# Altium project 遥控器主板.PrjPcb
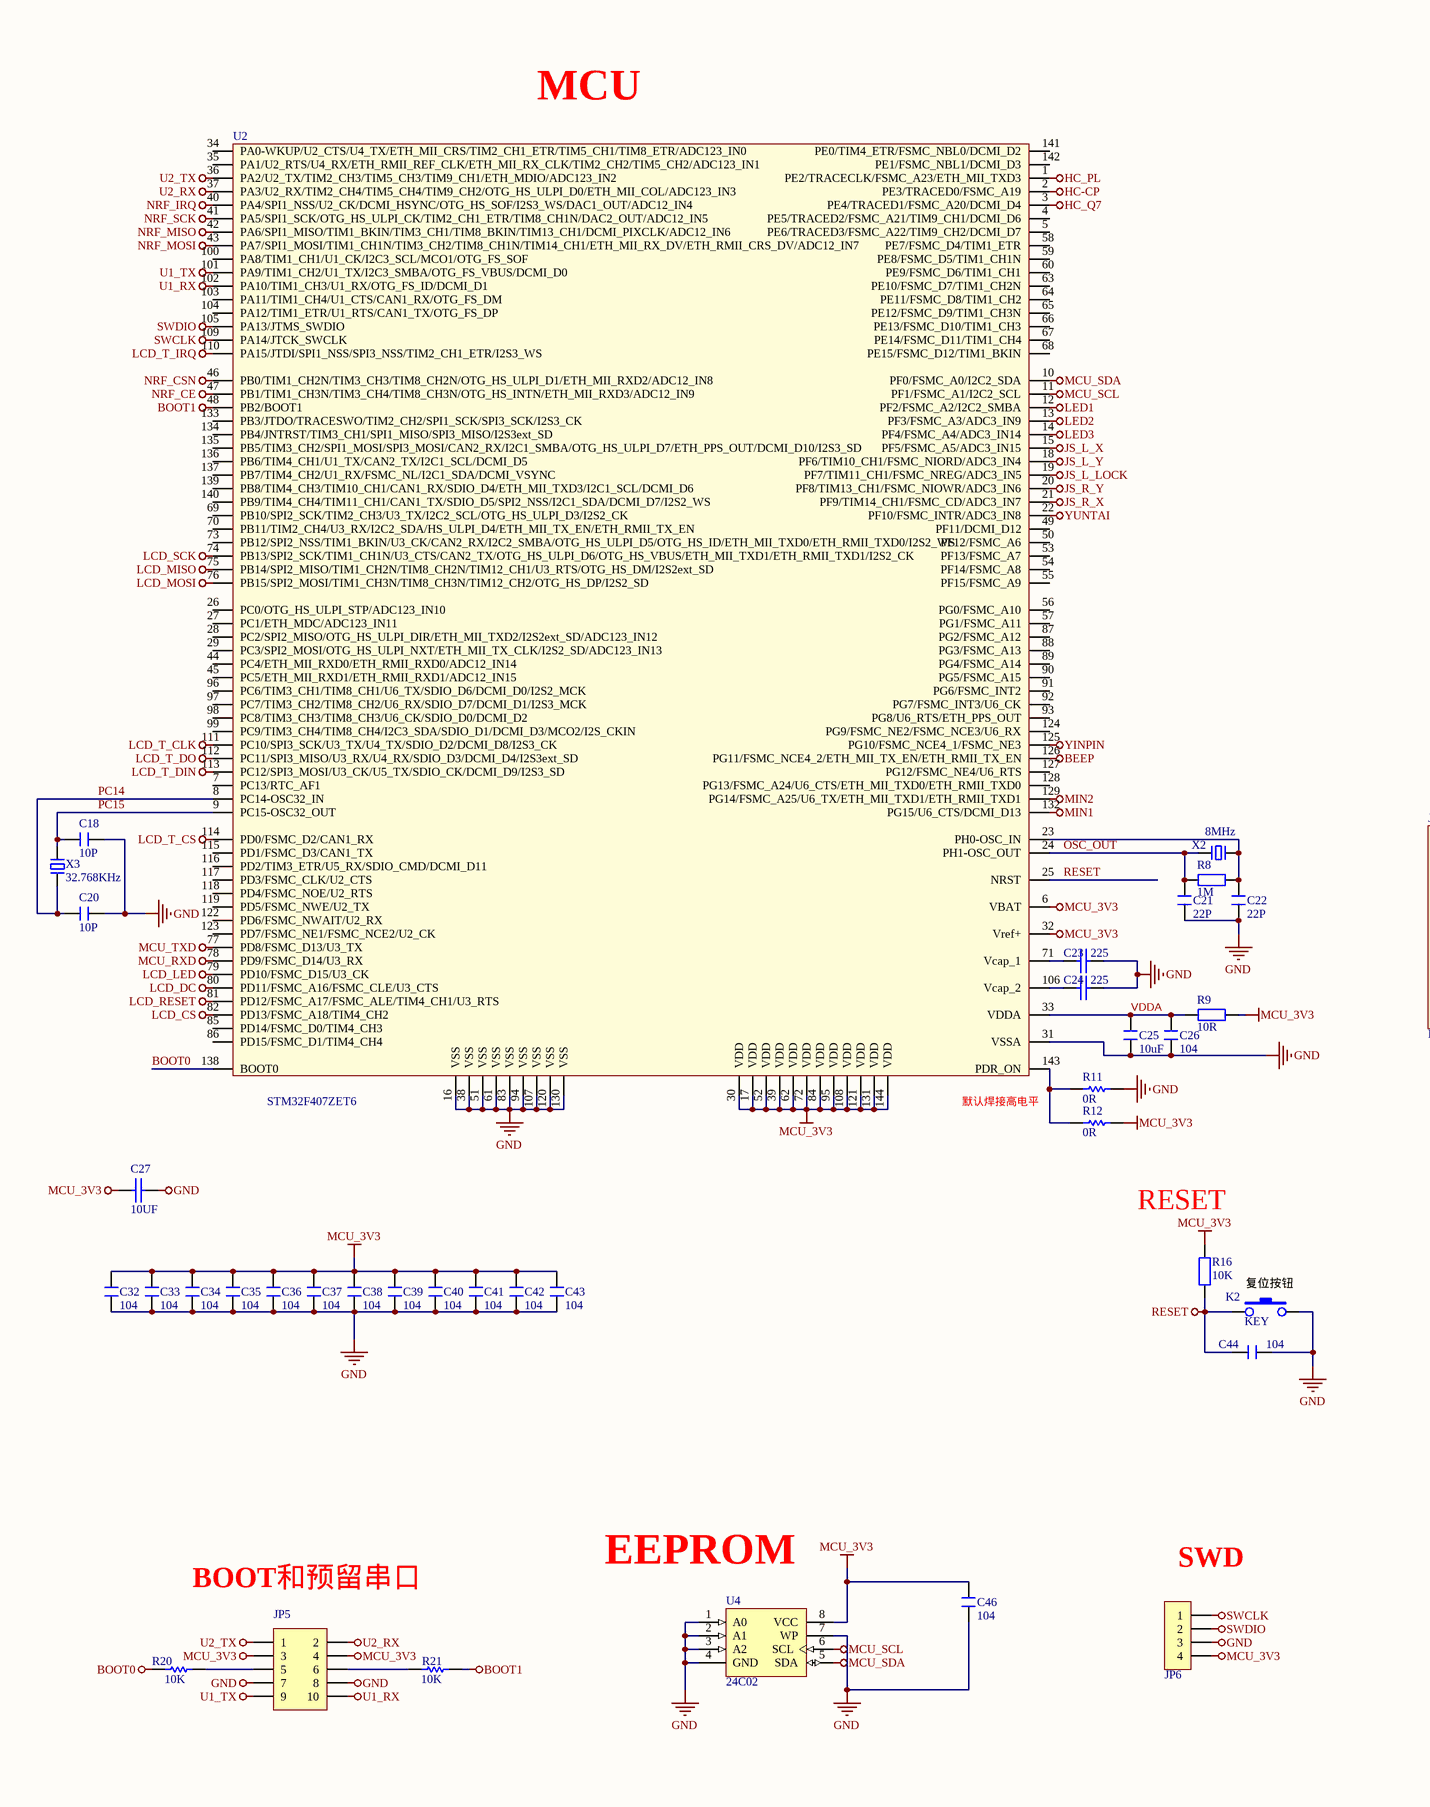
[diagram p0: 遥控器主板.SchDoc, left]
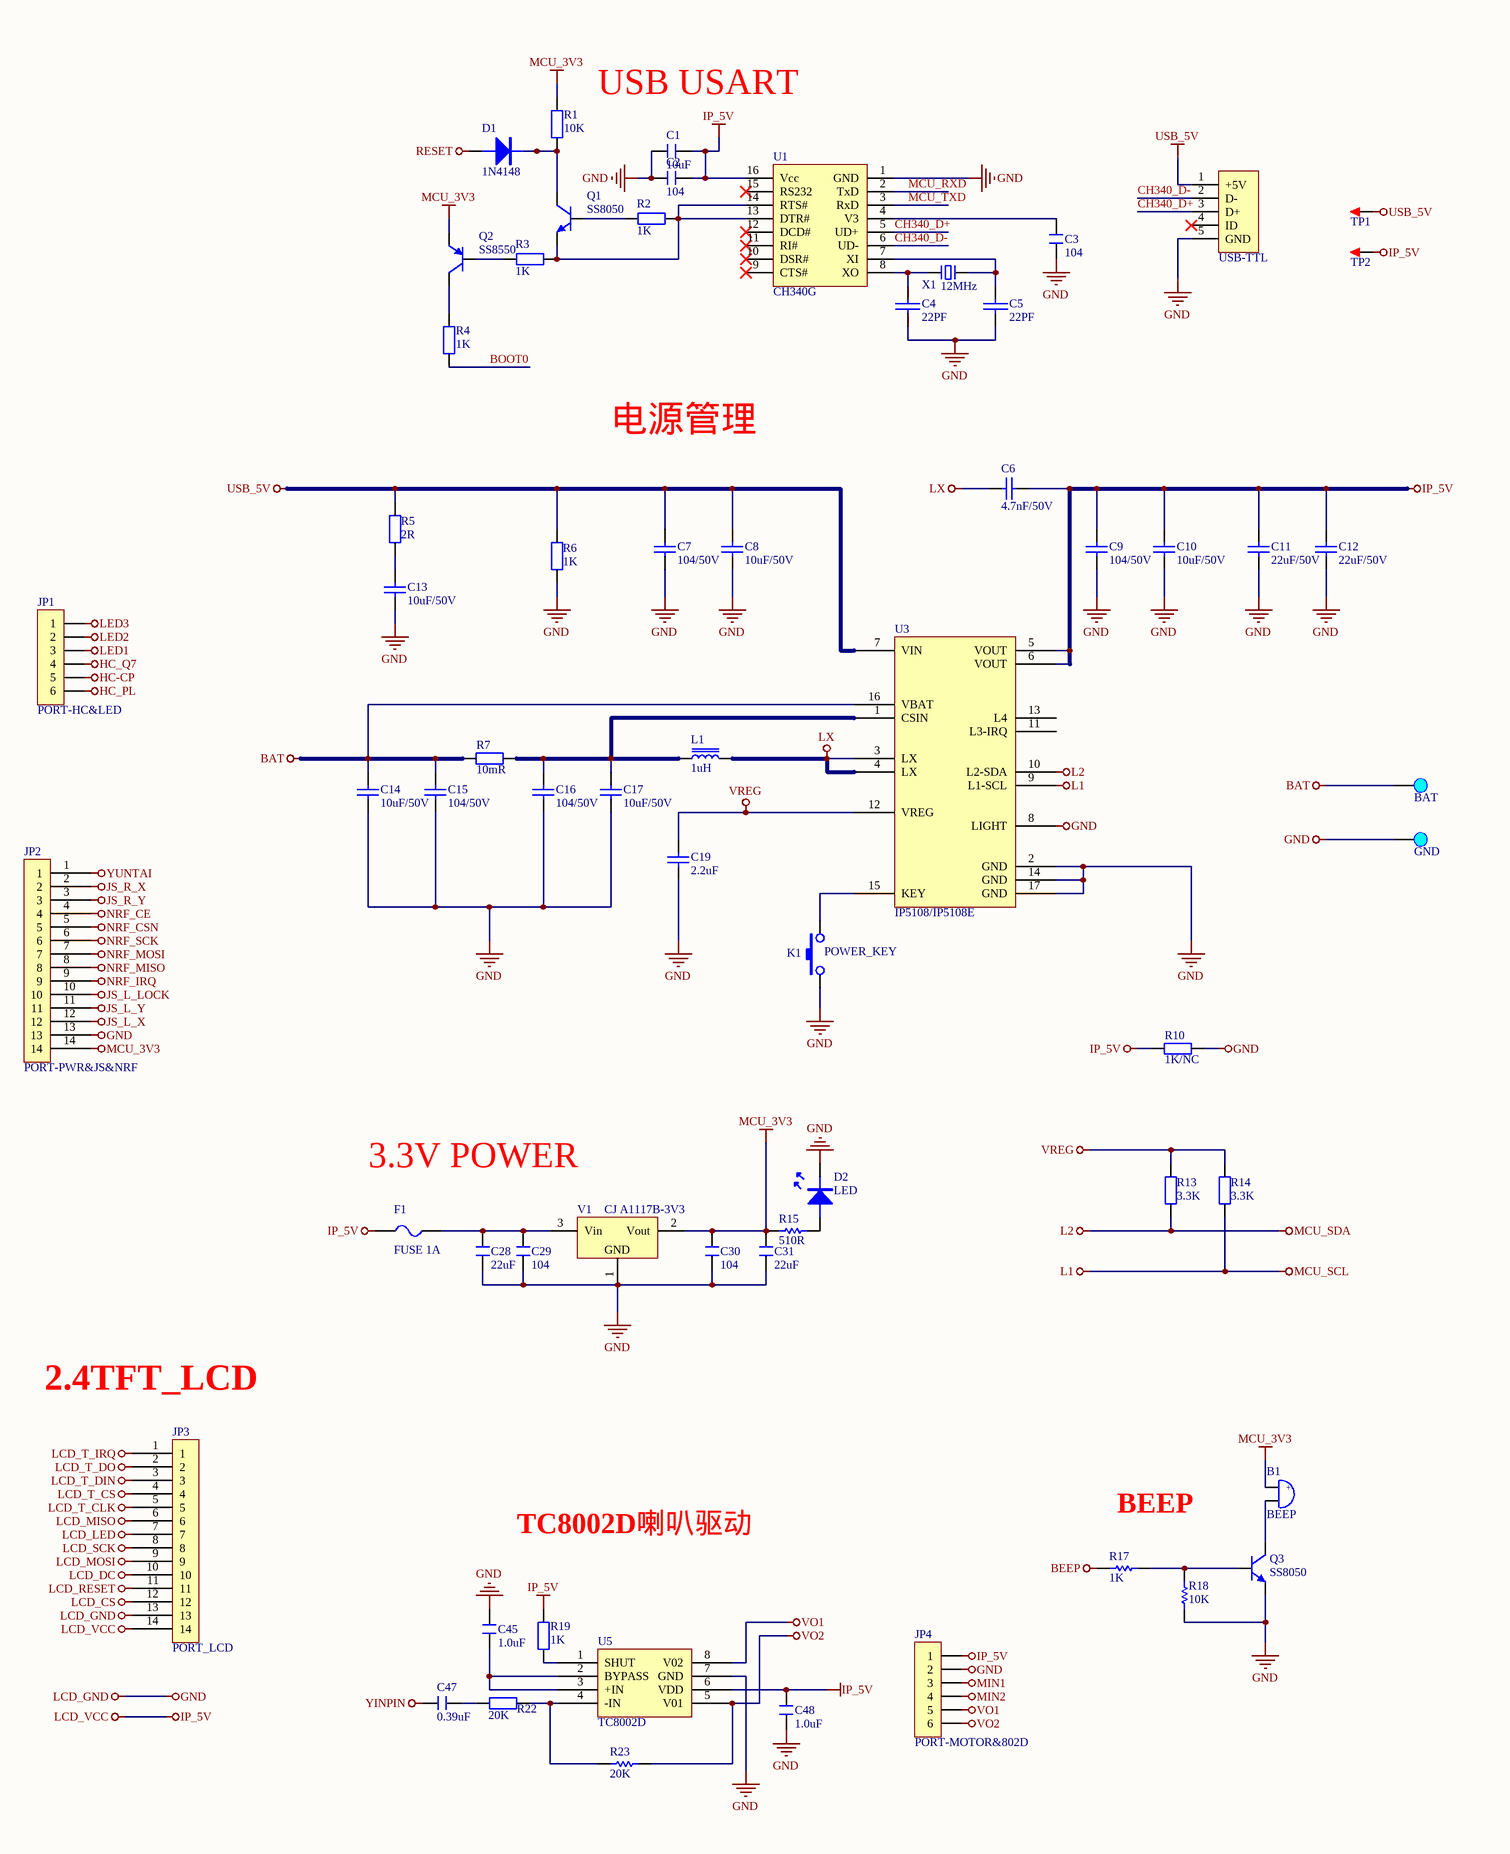
[diagram p1: 遥控器主板.SchDoc, right]
1 sheet, 101 parts. Net scope: global (net labels, ports and power ports of the same name join across sheets).
Board file: 遥控器主板.PcbDoc

## Sheet 遥控器主板.SchDoc
size A2

### Parts
B1  BEEP  [BEEP 7.6X12X7.5]
C1  10uF  [0603C]
C2  104  [0603C]
C3  104  [0603C]
C4  22PF  [0603C]
C5  22PF  [0603C]
C6  _Parameter: 4.7nF/50V  [0603C]  (hidden comment: 4.7nF)
C7  _Parameter: 104/50V  [0603C]  (hidden comment: 104)
C8  _Parameter: 10uF/50V  [0603C]  (hidden comment: 10uF)
C9  _Parameter: 104/50V  [0603C]  (hidden comment: 104)
C10  _Parameter: 10uF/50V  [0603C]  (hidden comment: 10uF)
C11  _Parameter: 22uF/50V  [0603C]  (hidden comment: 22uF)
C12  _Parameter: 22uF/50V  [0603C]  (hidden comment: 22uF)
C13  _Parameter: 10uF/50V  [0603C]  (hidden comment: 10uF)
C14  _Parameter: 10uF/50V  [0603C]  (hidden comment: 10uF)
C15  _Parameter: 104/50V  [0603C]  (hidden comment: 104)
C16  _Parameter: 104/50V  [0603C]  (hidden comment: 104)
C17  _Parameter: 10uF/50V  [0603C]  (hidden comment: 10uF)
C18  10P  [0603C]
C19  _Parameter: 2.2uF  [0603C]  (hidden comment: 104)
C20  10P  [0603C]
C21  22P  [0603C]
C22  22P  [0603C]
C23  225  [0603C]
C24  225  [0603C]
C25  10uF  [0603C]
C26  104  [0603C]
C27  10UF  [0603C]
C28  22uF  [0603C]
C29  104  [0603C]
C30  104  [0603C]
C31  22uF  [0603C]
C32  104  [0603C]
C33  104  [0603C]
C34  104  [0603C]
C35  104  [0603C]
C36  104  [0603C]
C37  104  [0603C]
C38  104  [0603C]
C39  104  [0603C]
C40  104  [0603C]
C41  104  [0603C]
C42  104  [0603C]
C43  104  [0603C]
C44  104  [0603C]
C45  1.0uF  [0603C]
C46  104  [0603C]
C47  0.39uF  [0603C]
C48  1.0uF  [0603C]
D1  1N4148  [SOD-323]
D2  LED  [LED-0603G]
F1  FUSE 1A  [FU 0805]
JP1  PORT-HC&LED  [SH1.0 S-W-6P]
JP2  PORT-PWR&JS&NRF  [Headr14]
JP3  PORT_LCD  [Headr14]
JP4  PORT-MOTOR&802D  [SH1.0 S-W-6P]
JP5  Header 5X2  [HDR2.54-LI-2x5P]  (value not drawn)
JP6  SWD  [XH2.54-WI-4P]  (value not drawn)
K1  POWER_KEY  [SMD-3X6X2.5]
K2  KEY  [SMD-3X6X2.5]
L1  1uH  [CD54]
Pad1  BAT  [TEST PAD 1.8]
Pad2  GND  [TEST PAD 1.8]
Q1  SS8050  [SOT23-3L]
Q2  SS8550  [SOT23-3L]
Q3  SS8050  [SOT23-3L]
R1  10K  [0805R]
R2  1K  [0805R]
R3  1K  [0805R]
R4  1K  [0805R]
R5  2R  [0805R]
R6  1K  [0805R]
R7  10mR  [2512R]
R8  1M  [0805R]
R9  10R  [0805R]
R10  1K/NC  [0805R]
R11  0R  [0805R]
R12  0R  [0805R]
R13  3.3K  [0805R]
R14  3.3K  [0805R]
R15  510R  [0805R]
R16  10K  [0805R]
R17  1K  [0805R]
R18  10K  [0805R]
R19  1K  [0805R]
R20  10K  [0805R]
R21  10K  [0805R]
R22  20K  [0805R]
R23  20K  [0805R]
TP1  TEST  [TEST PAD 1.8]  (value not drawn)
TP2  TEST  [TEST PAD 1.8]  (value not drawn)
U1  CH340G  [SOP16_L]
U2  STM32F407ZET6  [LQFP144 20X20_M]
U3  IP5108/IP5108E  [SOP16_PWR]
U4  24C02  [SOP8_L]
U5  TC8002D  [SOP8_L]
USB1  USB-TTL  [USB-MINI-A]
V1  CJ A1117B-3V3  [SOT89_L]
X1  12MHz  [OSC HC-49S]
X2  8MHz  [OSC HC-49S]
X3  32.768KHz  [OSC HC-49S]

### Nets
BAT: C14.2 C15.2 Pad1.1 R7.1 U3.16(VBAT)
BEEP: R17.1 U2.126(PG11/FSMC_NCE4_2/ETH_MII_TX_EN/ETH_RMII_TX_EN)
BOOT0: R4.2 R20.1 U2.138(BOOT0)
BOOT1: R21.2 U2.48(PB2/BOOT1)
GND: C1.1 C2.1 C3.1 C4.1 C5.1 C7.1 C8.1 C9.1 C10.1 C11.1 C12.1 C13.1 C14.1 C15.1 C16.1 C17.1 C18.2 C19.1 C20.2 C21.1 C22.1 C23.2 C24.2 C25.1 C26.1 C27.2 C28.1 C29.1 C30.1 C31.1 C32.1 C33.1 C34.1 C35.1 C36.1 C37.1 C38.1 C39.1 C40.1 C41.1 C42.1 C43.1 C44.1 C45.2 C46.1 C48.1 D2.K JP2.13 JP3.13 JP4.2 JP5.7 JP5.8 JP6.3 K1.1 K2.3 Pad2.1 Q3.2(E) R6.2 R10.2 R11.2 R18.1 U1.1(GND) U2.16(VSS) U2.31(VSSA) U2.38(VSS) U2.51(VSS) U2.61(VSS) U2.83(VSS) U2.94(VSS) U2.107(VSS) U2.120(VSS) U2.130(VSS) U3.2(GND) U3.8(LIGHT) U3.14(GND) U3.17(GND) U4.1(A0) U4.2(A1) U4.3(A2) U4.4(GND) U4.7(WP) U5.7(GND) USB1.5(GND) V1.1(GND)  [also labelled LCD_GND]
HC-CP: JP1.5 U2.2(PE3/TRACED0/FSMC_A19)
HC_PL: JP1.6 U2.1(PE2/TRACECLK/FSMC_A23/ETH_MII_TXD3)
HC_Q7: JP1.4 U2.3(PE4/TRACED1/FSMC_A20/DCMI_D4)
IP_5V: C1.2 C2.2 C6.1 C9.2 C10.2 C11.2 C12.2 C48.2 F1.1 JP3.14 JP4.1 R10.1 R19.2 TP2.1 U1.16(Vcc) U3.5(VOUT) U3.6(VOUT) U5.6(VDD)  [also labelled LCD_VCC]
JS_L_LOCK: JP2.10 U2.19(PF7/TIM11_CH1/FSMC_NREG/ADC3_IN5)
JS_L_X: JP2.12 U2.15(PF5/FSMC_A5/ADC3_IN15)
JS_L_Y: JP2.11 U2.18(PF6/TIM10_CH1/FSMC_NIORD/ADC3_IN4)
JS_R_X: JP2.2 U2.21(PF9/TIM14_CH1/FSMC_CD/ADC3_IN7)
JS_R_Y: JP2.3 U2.20(PF8/TIM13_CH1/FSMC_NIOWR/ADC3_IN6)
L1: R14.1 U2.11(PF1/FSMC_A1/I2C2_SCL) U3.9(L1-SCL) U4.6(SCL)  [also labelled MCU_SCL]
L2: R13.1 U2.10(PF0/FSMC_A0/I2C2_SDA) U3.10(L2-SDA) U4.5(SDA)  [also labelled MCU_SDA]
LCD_CS: JP3.12 U2.82(PD13/FSMC_A18/TIM4_CH2)
LCD_DC: JP3.10 U2.80(PD11/FSMC_A16/FSMC_CLE/U3_CTS)
LCD_LED: JP3.7 U2.79(PD10/FSMC_D15/U3_CK)
LCD_MISO: JP3.6 U2.75(PB14/SPI2_MISO/TIM1_CH2N/TIM8_CH2N/TIM12_CH1/U3_RTS/OTG_HS_DM/I2S2ext_SD)
LCD_MOSI: JP3.9 U2.76(PB15/SPI2_MOSI/TIM1_CH3N/TIM8_CH3N/TIM12_CH2/OTG_HS_DP/I2S2_SD)
LCD_RESET: JP3.11 U2.81(PD12/FSMC_A17/FSMC_ALE/TIM4_CH1/U3_RTS)
LCD_SCK: JP3.8 U2.74(PB13/SPI2_SCK/TIM1_CH1N/U3_CTS/CAN2_TX/OTG_HS_ULPI_D6/OTG_HS_VBUS/ETH_MII_TXD1/ETH_RMII_TXD1/I2S2_CK)
LCD_T_CLK: JP3.5 U2.111(PC10/SPI3_SCK/U3_TX/U4_TX/SDIO_D2/DCMI_D8/I2S3_CK)
LCD_T_CS: JP3.4 U2.114(PD0/FSMC_D2/CAN1_RX)
LCD_T_DIN: JP3.3 U2.113(PC12/SPI3_MOSI/U3_CK/U5_TX/SDIO_CK/DCMI_D9/I2S3_SD)
LCD_T_DO: JP3.2 U2.112(PC11/SPI3_MISO/U3_RX/U4_RX/SDIO_D3/DCMI_D4/I2S3ext_SD)
LCD_T_IRQ: JP3.1 U2.110(PA15/JTDI/SPI1_NSS/SPI3_NSS/TIM2_CH1_ETR/I2S3_WS)
LED1: JP1.3 U2.12(PF2/FSMC_A2/I2C2_SMBA)
LED2: JP1.2 U2.13(PF3/FSMC_A3/ADC3_IN9)
LED3: JP1.1 U2.14(PF4/FSMC_A4/ADC3_IN14)
LX: C6.2 L1.2 U3.3(LX) U3.4(LX)
MCU_3V3: B1.1 C27.1 C30.2 C31.2 C32.2 C33.2 C34.2 C35.2 C36.2 C37.2 C38.2 C39.2 C40.2 C41.2 C42.2 C43.2 C46.2 JP2.14 JP5.3 JP5.4 JP6.4 Q2.2(E) R1.2 R9.2 R12.2 R15.2 R16.2 U2.6(VBAT) U2.17(VDD) U2.30(VDD) U2.32(Vref+) U2.39(VDD) U2.52(VDD) U2.62(VDD) U2.72(VDD) U2.84(VDD) U2.95(VDD) U2.108(VDD) U2.121(VDD) U2.131(VDD) U2.144(VDD) U4.8(VCC) V1.2(Vout)
MCU_RXD: U1.2(TxD) U2.78(PD9/FSMC_D14/U3_RX)
MCU_TXD: U1.3(RxD) U2.77(PD8/FSMC_D13/U3_TX)
MIN1: JP4.3 U2.132(PG15/U6_CTS/DCMI_D13)
MIN2: JP4.4 U2.129(PG14/FSMC_A25/U6_TX/ETH_MII_TXD1/ETH_RMII_TXD1)
NRF_CE: JP2.4 U2.47(PB1/TIM1_CH3N/TIM3_CH4/TIM8_CH3N/OTG_HS_INTN/ETH_MII_RXD3/ADC12_IN9)
NRF_CSN: JP2.5 U2.46(PB0/TIM1_CH2N/TIM3_CH3/TIM8_CH2N/OTG_HS_ULPI_D1/ETH_MII_RXD2/ADC12_IN8)
NRF_IRQ: JP2.9 U2.40(PA4/SPI1_NSS/U2_CK/DCMI_HSYNC/OTG_HS_SOF/I2S3_WS/DAC1_OUT/ADC12_IN4)
NRF_MISO: JP2.8 U2.42(PA6/SPI1_MISO/TIM1_BKIN/TIM3_CH1/TIM8_BKIN/TIM13_CH1/DCMI_PIXCLK/ADC12_IN6)
NRF_MOSI: JP2.7 U2.43(PA7/SPI1_MOSI/TIM1_CH1N/TIM3_CH2/TIM8_CH1N/TIM14_CH1/ETH_MII_RX_DV/ETH_RMII_CRS_DV/ADC12_IN7)
NRF_SCK: JP2.6 U2.41(PA5/SPI1_SCK/OTG_HS_ULPI_CK/TIM2_CH1_ETR/TIM8_CH1N/DAC2_OUT/ADC12_IN5)
RESET: C44.2 D1.A K2.1 R16.1 U2.25(NRST)
SWCLK: JP6.1 U2.109(PA14/JTCK_SWCLK)
SWDIO: JP6.2 U2.105(PA13/JTMS_SWDIO)
U1_RX: JP5.10 U2.102(PA10/TIM1_CH3/U1_RX/OTG_FS_ID/DCMI_D1)
U1_TX: JP5.9 U2.101(PA9/TIM1_CH2/U1_TX/I2C3_SMBA/OTG_FS_VBUS/DCMI_D0)
U2_RX: JP5.2 U2.37(PA3/U2_RX/TIM2_CH4/TIM5_CH4/TIM9_CH2/OTG_HS_ULPI_D0/ETH_MII_COL/ADC123_IN3)
U2_TX: JP5.1 U2.36(PA2/U2_TX/TIM2_CH3/TIM5_CH3/TIM9_CH1/ETH_MDIO/ADC123_IN2)
USB_5V: C7.2 C8.2 R5.1 R6.1 TP1.1 U3.7(VIN) USB1.1(+5V)
VO1: JP4.5 U5.8(V02)
VO2: JP4.6 R23.2 U5.5(V01)
VREG: C19.2 R13.2 R14.2 U3.12(VREG)
YINPIN: C47.2 U2.125(PG10/FSMC_NCE4_1/FSMC_NE3)
YUNTAI: JP2.1 U2.22(PF10/FSMC_INTR/ADC3_IN8)
CH340_D+: U1.5(UD+) USB1.3(D+)
CH340_D-: U1.6(UD-) USB1.2(D-)
OSC_OUT: C21.2 R8.1 U2.24(PH1-OSC_OUT) X2.2
PC14: C20.1 U2.8(PC14-OSC32_IN) X3.1
PC15: C18.1 U2.9(PC15-OSC32_OUT) X3.2
VDDA: C25.2 C26.2 R9.1 U2.33(VDDA)
NetB1_2: B1.2 Q3.3(C)
NetC3_2: C3.2 U1.4(V3)
NetC4_2: C4.2 U1.8(XO) X1.1
NetC5_2: C5.2 U1.7(XI) X1.2
NetC13_2: C13.2 R5.2
NetC16_2: C16.2 C17.2 L1.1 R7.2 U3.1(CSIN)
NetC22_2: C22.2 R8.2 U2.23(PH0-OSC_IN) X2.1
NetC23_1: C23.1 U2.71(Vcap_1)
NetC24_1: C24.1 U2.106(Vcap_2)
NetC28_2: C28.2 C29.2 F1.2 V1.3(Vin)
NetC45_1: C45.1 U5.2(BYPASS) U5.3(+IN)
NetC47_1: C47.1 R22.1
NetD1_K: D1.K Q1.3(C) R1.1
NetD2_A: D2.A R15.1
NetJP5_5: JP5.5 R20.2
NetJP5_6: JP5.6 R21.1
NetK1_3: K1.3 U3.15(KEY)
NetQ1_1: Q1.1(B) R2.2
NetQ1_2: Q1.2(E) R2.1 R3.1 U1.13(DTR#) U1.14(RTS#)
NetQ2_1: Q2.1(B) R3.2
NetQ2_3: Q2.3(C) R4.1
NetQ3_1: Q3.1(B) R17.2 R18.2
NetR11_1: R11.1 R12.1 U2.143(PDR_ON)
NetR19_1: R19.1 U5.1(SHUT)
NetR22_2: R22.2 R23.1 U5.4(-IN)

Not connected (* = marked no-connect by the designer): U1 9(CTS#)* 10(DSR#)* 11(RI#)* 12(DCD#)* 15(RS232)*; U2 4(PE5/TRACED2/FSMC_A21/TIM9_CH1/DCMI_D6) 5(PE6/TRACED3/FSMC_A22/TIM9_CH2/DCMI_D7) 7(PC13/RTC_AF1) 26(PC0/OTG_HS_ULPI_STP/ADC123_IN10) 27(PC1/ETH_MDC/ADC123_IN11) 28(PC2/SPI2_MISO/OTG_HS_ULPI_DIR/ETH_MII_TXD2/I2S2ext_SD/ADC123_IN12) 29(PC3/SPI2_MOSI/OTG_HS_ULPI_NXT/ETH_MII_TX_CLK/I2S2_SD/ADC123_IN13) 34(PA0-WKUP/U2_CTS/U4_TX/ETH_MII_CRS/TIM2_CH1_ETR/TIM5_CH1/TIM8_ETR/ADC123_IN0) 35(PA1/U2_RTS/U4_RX/ETH_RMII_REF_CLK/ETH_MII_RX_CLK/TIM2_CH2/TIM5_CH2/ADC123_IN1) 44(PC4/ETH_MII_RXD0/ETH_RMII_RXD0/ADC12_IN14) 45(PC5/ETH_MII_RXD1/ETH_RMII_RXD1/ADC12_IN15) 49(PF11/DCMI_D12) 50(PF12/FSMC_A6) 53(PF13/FSMC_A7) 54(PF14/FSMC_A8) 55(PF15/FSMC_A9) 56(PG0/FSMC_A10) 57(PG1/FSMC_A11) 58(PE7/FSMC_D4/TIM1_ETR) 59(PE8/FSMC_D5/TIM1_CH1N) 60(PE9/FSMC_D6/TIM1_CH1) 63(PE10/FSMC_D7/TIM1_CH2N) 64(PE11/FSMC_D8/TIM1_CH2) 65(PE12/FSMC_D9/TIM1_CH3N) 66(PE13/FSMC_D10/TIM1_CH3) 67(PE14/FSMC_D11/TIM1_CH4) 68(PE15/FSMC_D12/TIM1_BKIN) 69(PB10/SPI2_SCK/TIM2_CH3/U3_TX/I2C2_SCL/OTG_HS_ULPI_D3/I2S2_CK) 70(PB11/TIM2_CH4/U3_RX/I2C2_SDA/HS_ULPI_D4/ETH_MII_TX_EN/ETH_RMII_TX_EN) 73(PB12/SPI2_NSS/TIM1_BKIN/U3_CK/CAN2_RX/I2C2_SMBA/OTG_HS_ULPI_D5/OTG_HS_ID/ETH_MII_TXD0/ETH_RMII_TXD0/I2S2_WS) 85(PD14/FSMC_D0/TIM4_CH3) 86(PD15/FSMC_D1/TIM4_CH4) 87(PG2/FSMC_A12) 88(PG3/FSMC_A13) 89(PG4/FSMC_A14) 90(PG5/FSMC_A15) 91(PG6/FSMC_INT2) 92(PG7/FSMC_INT3/U6_CK) 93(PG8/U6_RTS/ETH_PPS_OUT) 96(PC6/TIM3_CH1/TIM8_CH1/U6_TX/SDIO_D6/DCMI_D0/I2S2_MCK) 97(PC7/TIM3_CH2/TIM8_CH2/U6_RX/SDIO_D7/DCMI_D1/I2S3_MCK) 98(PC8/TIM3_CH3/TIM8_CH3/U6_CK/SDIO_D0/DCMI_D2) 99(PC9/TIM3_CH4/TIM8_CH4/I2C3_SDA/SDIO_D1/DCMI_D3/MCO2/I2S_CKIN) 100(PA8/TIM1_CH1/U1_CK/I2C3_SCL/MCO1/OTG_FS_SOF) 103(PA11/TIM1_CH4/U1_CTS/CAN1_RX/OTG_FS_DM) 104(PA12/TIM1_ETR/U1_RTS/CAN1_TX/OTG_FS_DP) 115(PD1/FSMC_D3/CAN1_TX) 116(PD2/TIM3_ETR/U5_RX/SDIO_CMD/DCMI_D11) 117(PD3/FSMC_CLK/U2_CTS) 118(PD4/FSMC_NOE/U2_RTS) 119(PD5/FSMC_NWE/U2_TX) 122(PD6/FSMC_NWAIT/U2_RX) 123(PD7/FSMC_NE1/FSMC_NCE2/U2_CK) 124(PG9/FSMC_NE2/FSMC_NCE3/U6_RX) 127(PG12/FSMC_NE4/U6_RTS) 128(PG13/FSMC_A24/U6_CTS/ETH_MII_TXD0/ETH_RMII_TXD0) 133(PB3/JTDO/TRACESWO/TIM2_CH2/SPI1_SCK/SPI3_SCK/I2S3_CK) 134(PB4/JNTRST/TIM3_CH1/SPI1_MISO/SPI3_MISO/I2S3ext_SD) 135(PB5/TIM3_CH2/SPI1_MOSI/SPI3_MOSI/CAN2_RX/I2C1_SMBA/OTG_HS_ULPI_D7/ETH_PPS_OUT/DCMI_D10/I2S3_SD) 136(PB6/TIM4_CH1/U1_TX/CAN2_TX/I2C1_SCL/DCMI_D5) 137(PB7/TIM4_CH2/U1_RX/FSMC_NL/I2C1_SDA/DCMI_VSYNC) 139(PB8/TIM4_CH3/TIM10_CH1/CAN1_RX/SDIO_D4/ETH_MII_TXD3/I2C1_SCL/DCMI_D6) 140(PB9/TIM4_CH4/TIM11_CH1/CAN1_TX/SDIO_D5/SPI2_NSS/I2C1_SDA/DCMI_D7/I2S2_WS) 141(PE0/TIM4_ETR/FSMC_NBL0/DCMI_D2) 142(PE1/FSMC_NBL1/DCMI_D3); U3 11(L3-IRQ) 13(L4); USB1 4(ID)*

### Notes on the sheet
- USB USART
- (near U2) MCU
- 电源管理
- (near U2) 默认焊接高电平
- 3.3V POWER
- (near R16) RESET
- (near K2) 复位按钮
- 2.4TFT_LCD
- BEEP
- (near U4) EEPROM
- (near JP6) SWD
- TC8002D喇叭驱动
- BOOT和预留串口
- (in symbol BEEP) +

### Library data of the parts
B1 = BEEP: 蜂鸣器
C1-C3 C18 C20-C22 C25 C26 C28-C48 = C: 无极性贴片电容; 版权归属: 源创客; 材质: X7R; BOM名称: 无极性贴片电容; 学习资源: www.ooocke.com
C4 C5 C23 C24 C27 = CAP: 无极性电容
C6 = Cap: _Material: X7R; _Voltage: 50V; _Slash: /; _Specification: Cap,0805,X7R,4.7nF,50V,10%; _Comma: ,; _Accuracy: 10%; _Footprint: 0805; _Capacitance: 4.7nF; _Name: Cap
C7 C9 C15 C16 C19 = Cap: _Material: X7R; _Voltage: 50V; _Slash: /; _Specification: Cap,0805,X7R,104,50V,10%; _Comma: ,; _Accuracy: 10%; _Footprint: 0805; _Capacitance: 104; _Name: Cap
C8 C10 C13 C14 C17 = Cap: _Material: X7R; _Voltage: 50V; _Slash: /; _Specification: Cap,0805,X7R,10uF,50V,10%; _Comma: ,; _Accuracy: 10%; _Footprint: 0805; _Capacitance: 10uF; _Name: Cap
C11 C12 = Cap: _Material: X7R; _Voltage: 50V; _Slash: /; _Specification: Cap,0805,X7R,22uF,50V,10%; _Comma: ,; _Accuracy: 10%; _Footprint: 0805; _Capacitance: 22uF; _Name: Cap
D1 = DIODE: 普通二极管
F1 = FU: 贴片保险丝; 版权归属: 源创客; BOM名称: 贴片保险丝; 学习资源: www.ooocke.com
JP1 JP4 = Header 6: 6P接插件; 版权归属: 源创客; BOM名称: 6P接插件; 学习资源: www.ooocke.com
JP2 JP3 = HEADER 14: 卧贴 14PIN 1.25mm
JP5 = Header 5X2: 5*2P接插件; 版权归属: 源创客; BOM名称: 5*2P接插件; 学习资源: www.ooocke.com
JP6 = Header 4: 4P接插件; 版权归属: 源创客; BOM名称: 4P接插件; 学习资源: www.ooocke.com
K1 = KEY
L1 = Inductor Iron 2: _Current: 10A; _Accuracy: 20%; _Footprint: 1040; _Name: IND; _Specification: IND,1040,1uH,10A,20%; _Comma: ,; _Value: 1uH
Pad1 = Pad: _Funcyusa: Test; _Specification: Pad,Test,BAT; _Comma: ,; _Name: Pad; _Remarks: BAT
Pad2 = Pad: _Funcyusa: Test; _Specification: Pad,Test,GND; _Comma: ,; _Name: Pad; _Remarks: GND
Q1 Q3 = 8050-SMD: 高频放大-NPN型; 版权归属: 源创客; 属性: 40V 1.5A 1W 100MHZ; BOM名称: 高频放大-NPN型; 学习资源: www.ooocke.com
Q2 = 8550-SMD: 高频放大-PNP型; 版权归属: 源创客; 属性: 40V 1.5A 1W 100MHZ; BOM名称: 高频放大-PNP型; 学习资源: www.ooocke.com
R1-R4 R8 R9 R16 R19 R22 = R: 贴片电阻; 版权归属: 源创客; BOM名称: 贴片电阻; 学习资源: www.ooocke.com
R5 = Res: _Accuracy: 1%; _Power: 1/8W; _Footprint: 0805; _Drift: 100ppm; _Comma: ,; _Specification: Res,0805,2R,1%,1/8W,100ppm; _Name: Res; _Value: 2R
R6 = Res: _Accuracy: 1%; _Power: 1/8W; _Footprint: 0805; _Drift: 100ppm; _Comma: ,; _Specification: Res,0805,1K,1%,1/8W,100ppm; _Name: Res; _Value: 1K
R7 = Res: _Accuracy: 1%; _Power: 1/8W; _Footprint: 0805; _Drift: 100ppm; _Comma: ,; _Specification: Res,0805,10mR,1%,1/8W,100ppm; _Name: Res; _Value: 10mR
R10 = Res: _Accuracy: 1%; _Power: 1/8W; _Footprint: 0805; _Drift: 100ppm; _Comma: ,; _Specification: Res,0805,1K/NC,1%,1/8W,100ppm; _Name: Res; _Value: 1K/NC
R11 R12 R15 R17 R18 R20 R21 R23 = RES
R13 R14 = Res: _Accuracy: 1%; _Power: 1/8W; _Footprint: 0805; _Drift: 100ppm; _Comma: ,; _Specification: Res,0805,3.3K,1%,1/8W,100ppm; _Name: Res; _Value: 3.3K
TP1 TP2 = TEST: 测试点; 版权归属: 源创客; BOM名称: 测试点; 学习资源: www.ooocke.com
U1 = CH340G: 串口转USB; 版权归属: 源创客; BOM名称: 串口转USB; 学习资源: www.ooocke.com
U3 = IP5108/IP5108E: 2A/1A Charger SoC
U4 = 24Cxx: 外置EEPROM; 版权归属: 源创客; BOM名称: 外置EEPROM; 学习资源: www.ooocke.com
U5 = TC8002D: SOP_8功放IC
USB1 = USB-5P: 微型USB母座; 版权归属: 源创客; BOM名称: 微型USB母座; 学习资源: www.ooocke.com
V1 = AMS1117: 三端稳压芯片; BOM名称: 稳压芯片; 版权归属: 源创客; 学习资源: www.ooocke.com
X1 = XTAL-2P: 2脚无源脚晶振
X2 X3 = XTAL-2P: 2脚无源脚晶振; 版权归属: 源创客; 负载电容: CL20pF; BOM名称: 2脚无源脚晶振; 学习资源: www.ooocke.com